# Altium schematic sheet Power.SchDoc
size A4; SheetNumber: 3; SheetTotal: 4
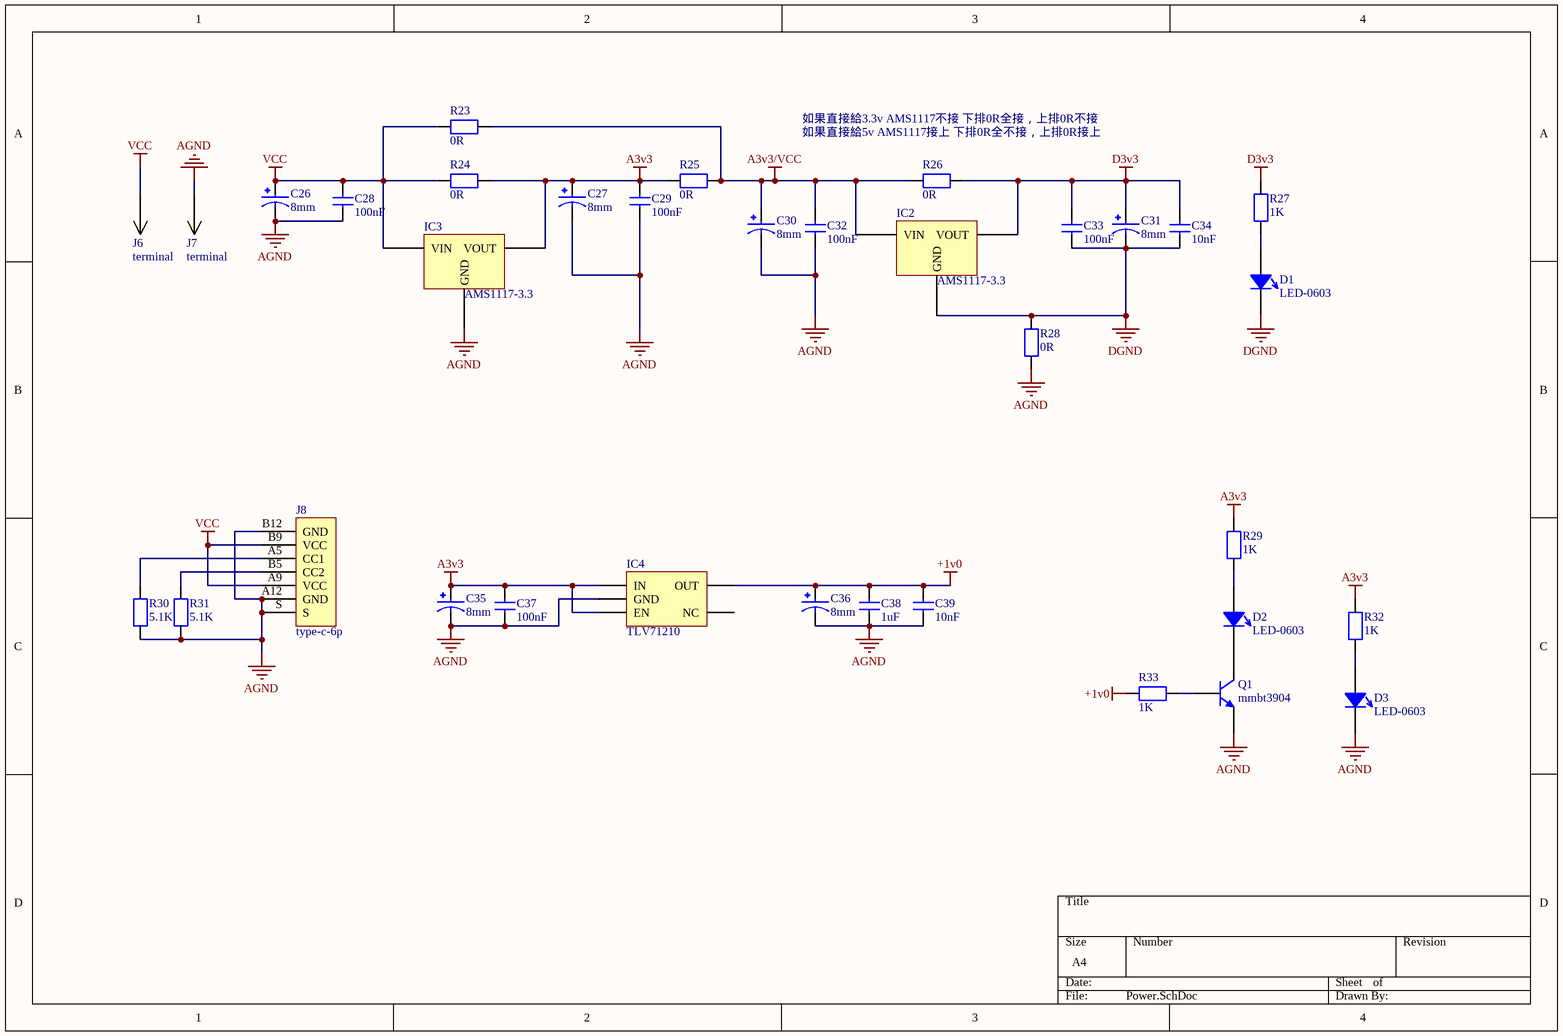
[diagram p0: Power.SchDoc]

## Parts
C26  8mm  [CAP_dual]
C27  8mm  [CAP_dual]
C28  100nF  [C-0603]
C29  100nF  [C-0603]
C30  8mm  [CAP_dual]
C31  8mm  [CAP_dual]
C32  100nF  [C-0603]
C33  100nF  [C-0603]
C34  10nF  [C-0603]
C35  8mm  [CAP_dual]
C36  8mm  [CAP_dual]
C37  100nF  [C-0603]
C38  1uF  [C-0603]
C39  10nF  [C-0603]
D1  LED-0603  [LED-0603]
D2  LED-0603  [LED-0603]
D3  LED-0603  [LED-0603]
IC2  AMS1117-3.3  [SOT-223]
IC3  AMS1117-3.3  [SOT-223]
IC4  TLV71210  [SOT95P245X110-5L]
J6  terminal  [Terminal-6.3mm]
J7  terminal  [Terminal-6.3mm]
J8  type-c-6p  [type-c_6p]
Q1  mmbt3904  [SOT23-L]
R23  0R  [RESMELF3515L]
R24  0R  [RESMELF3515L]
R25  0R  [RESMELF3515L]
R26  0R  [RESMELF3515L]
R27  1K  [RESMELF3515L]
R28  0R  [RESMELF3515L]
R29  1K  [RESMELF3515L]
R30  5.1K  [R-0603]
R31  5.1K  [R-0603]
R32  1K  [RESMELF3515L]
R33  1K  [RESMELF3515L]

## Nets
+1v0: C36.1 C38.2 C39.2 IC4.5(OUT) R33.2
A3v3: C27.1 C29.2 C35.1 C37.2 IC3.2(VOUT) IC4.1(IN) IC4.3(EN) R24.2 R25.1 R29.2 R32.2
A3v3/VCC: C30.1 C32.2 IC2.3(VIN) R23.2 R25.2 R26.1
AGND: C26.2 C27.2 C28.1 C29.1 C30.2 C32.1 C35.2 C36.2 C37.1 C38.1 C39.1 D3.2 IC3.1(GND) IC4.2(GND) J7.1 J8.A12(GND) J8.B12(GND) J8.S Q1.2(E) R28.1 R30.2 R31.2
D3v3: C31.1 C33.2 C34.2 IC2.2(VOUT) R26.2 R27.2
DGND: C31.2 C33.1 C34.1 D1.2 IC2.1(GND) R28.2
VCC: C26.1 C28.2 IC3.3(VIN) J6.1 J8.A9(VCC) J8.B9(VCC) R23.1 R24.1
NetD1_1: D1.1 R27.1
NetD2_1: D2.1 R29.1
NetD2_2: D2.2 Q1.3(C)
NetD3_1: D3.1 R32.1
NetJ8_A5: J8.A5(CC1) R30.1
NetJ8_B5: J8.B5(CC2) R31.1
NetQ1_1: Q1.1(B) R33.1

Not connected (* = marked no-connect by the designer): IC4 4(NC)

## Notes on the sheet
- 如果直接給3.3v AMS1117不接 下排0R全接，上排0R不接
- (near R26) 如果直接給5v AMS1117接上 下排0R全不接，上排0R接上

## Library data of the parts
C26 C27 C30 C31 C35 C36 = dip-cap: 8mm cap
C28 C29 C32-C34 C37-C39 = C-0603
IC4 = TLV71210: 1V LDO TLV71210DBVR / AP7335-10WG-7
J6 J7 = 6.3mm-terminal
J8 = type-c-6p: C668623
Q1 = NPN
R23 R25 R26 R28 = CSR-0204: Bypass
R24 = CSR-0204: Bypsaa
R27 R29 R32 R33 = CSR-0204
R30 R31 = R-0603